# Altium project Zenit Stand_v3.PrjPcb
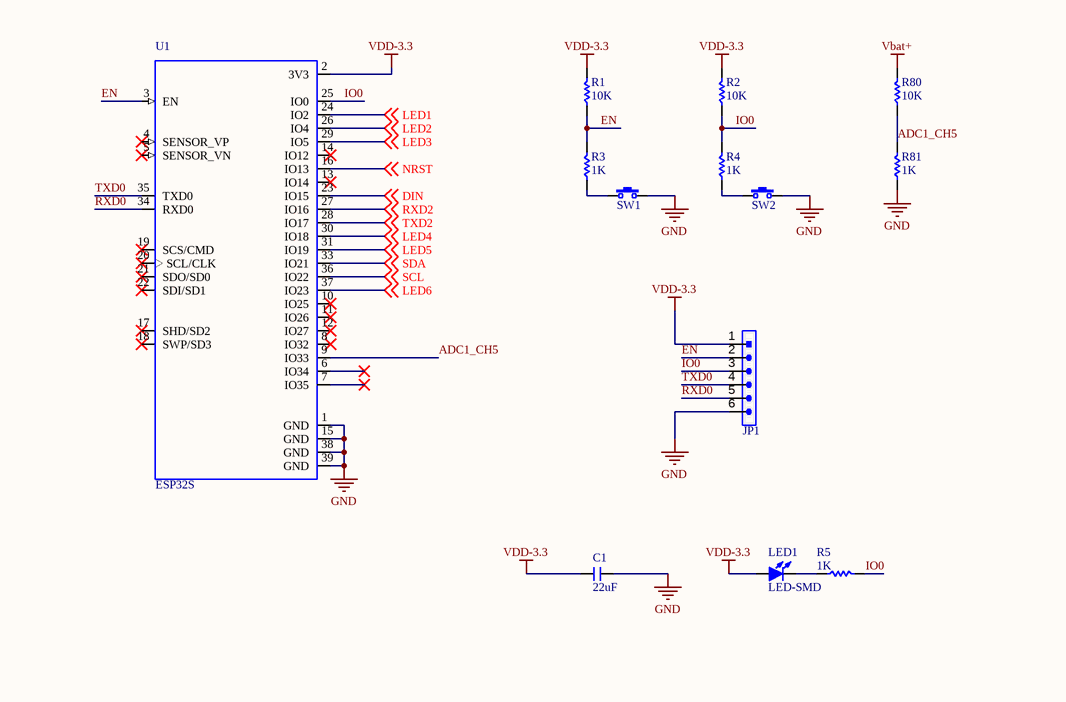
[diagram p0: ESP32.SchDoc]
5 sheets, 130 parts. Net scope: global (net labels, ports and power ports of the same name join across sheets).
Board file: Zenit Stand PCB_3.PcbDoc
Sheets:
  ESP32.SchDoc
  Vemos Battry Shield.SchDoc
  Main.SchDoc
  MPR121.SchDoc
  WS2812.SchDoc

## Sheet ESP32.SchDoc
size A4; SheetNumber: 1; SheetTotal: 6

### Parts
C1  22uF  [C 0805]
JP1  HDR-1X6  [HDR-1X6]  (value not drawn)
LED1  LED-SMD  [LED 0805B]
R1  10K  [R 0805]
R2  10K  [R 0805]
R3  1K  [R 0805]
R4  1K  [R 0805]
R5  1K  [R 0805]
R80  10K  [R 0805]
R81  1K  [R 0805]
SW1  3x6x5  [TSW SMD-3*6*2.5]  (value not drawn)
SW2  3x6x5  [TSW SMD-3*6*2.5]  (value not drawn)
U1  ESP32S  [ESP32S]

### Nets
GND: C1.2 JP1.6 R81.1 SW1.2 SW2.2 U1.1(GND) U1.15(GND) U1.38(GND) U1.39(GND)
Vbat+: R80.2
VDD-3.3: C1.1 JP1.1 LED1.1(A) R1.2 R2.2 U1.2(3V3)
ADC1_CH5: R80.1 R81.2 U1.9(IO33)
DIN: U1.23(IO15) ; off-sheet DIN
EN: JP1.2 R1.1 R3.2 U1.3(EN)
IO0: JP1.3 R2.1 R4.2 R5.2 U1.25(IO0)
LED1: U1.24(IO2) ; off-sheet LED1
LED2: U1.26(IO4) ; off-sheet LED2
LED3: U1.29(IO5) ; off-sheet LED3
LED4: U1.30(IO18) ; off-sheet LED4
LED5: U1.31(IO19) ; off-sheet LED5
LED6: U1.37(IO23) ; off-sheet LED6
NRST: U1.16(IO13) ; off-sheet NRST
RXD0: JP1.5 U1.34(RXD0)
RXD2: U1.27(IO16) ; off-sheet RXD2
SCL: U1.36(IO22) ; off-sheet SCL
SDA: U1.33(IO21) ; off-sheet SDA
TXD0: JP1.4 U1.35(TXD0)
TXD2: U1.28(IO17) ; off-sheet TXD2
NetLED1_2: LED1.2(K) R5.1
NetR3_1: R3.1 SW1.1
NetR4_1: R4.1 SW2.1

Not connected (* = marked no-connect by the designer): U1 4(SENSOR_VP)* 5(SENSOR_VN)* 6(IO34)* 7(IO35)* 8(IO32)* 10(IO25)* 11(IO26)* 12(IO27)* 13(IO14)* 14(IO12)* 17(SHD/SD2)* 18(SWP/SD3)* 19(SCS/CMD)* 20(SCL/CLK)* 21(SDO/SD0)* 22(SDI/SD1)*

### Library data of the parts
C1 = C: Non-polar patch capacitor; BOM名称: 无极性贴片电容; 版权归属: 源创客; 学习资源: www.ooocke.com
JP1 = Header 6: 6P Connector; BOM名称: 6P接插件; 版权归属: 源创客; 学习资源: www.ooocke.com
LED1 = LED-SMD: Patch LED; BOM名称: 贴片LED; 版权归属: 源创客; 学习资源: www.ooocke.com
R1-R5 R80 R81 = R: Chip resistor; 版权归属: 源创客; BOM名称: Chip resistor; 学习资源: www.ooocke.com
SW1 SW2 = TSW 3x6: 3x6 tact switch; BOM名称: 3x6轻触开关; 版权归属: 源创客; 学习资源: www.ooocke.com
U1 = ESP32S: MP: ESP32-WROOM-32D; MF: Espressif Systems; Package: Module Espressif Systems; Price: None; Availability: Unavailable; SnapEDA_Link: https://www.snapeda.com/parts/ESP32-WROOM-32D/Espressif%20Systems/view-part/?ref=snap; Value: *

## Sheet Vemos Battry Shield.SchDoc
size A; SheetNumber: 2; SheetTotal: 6
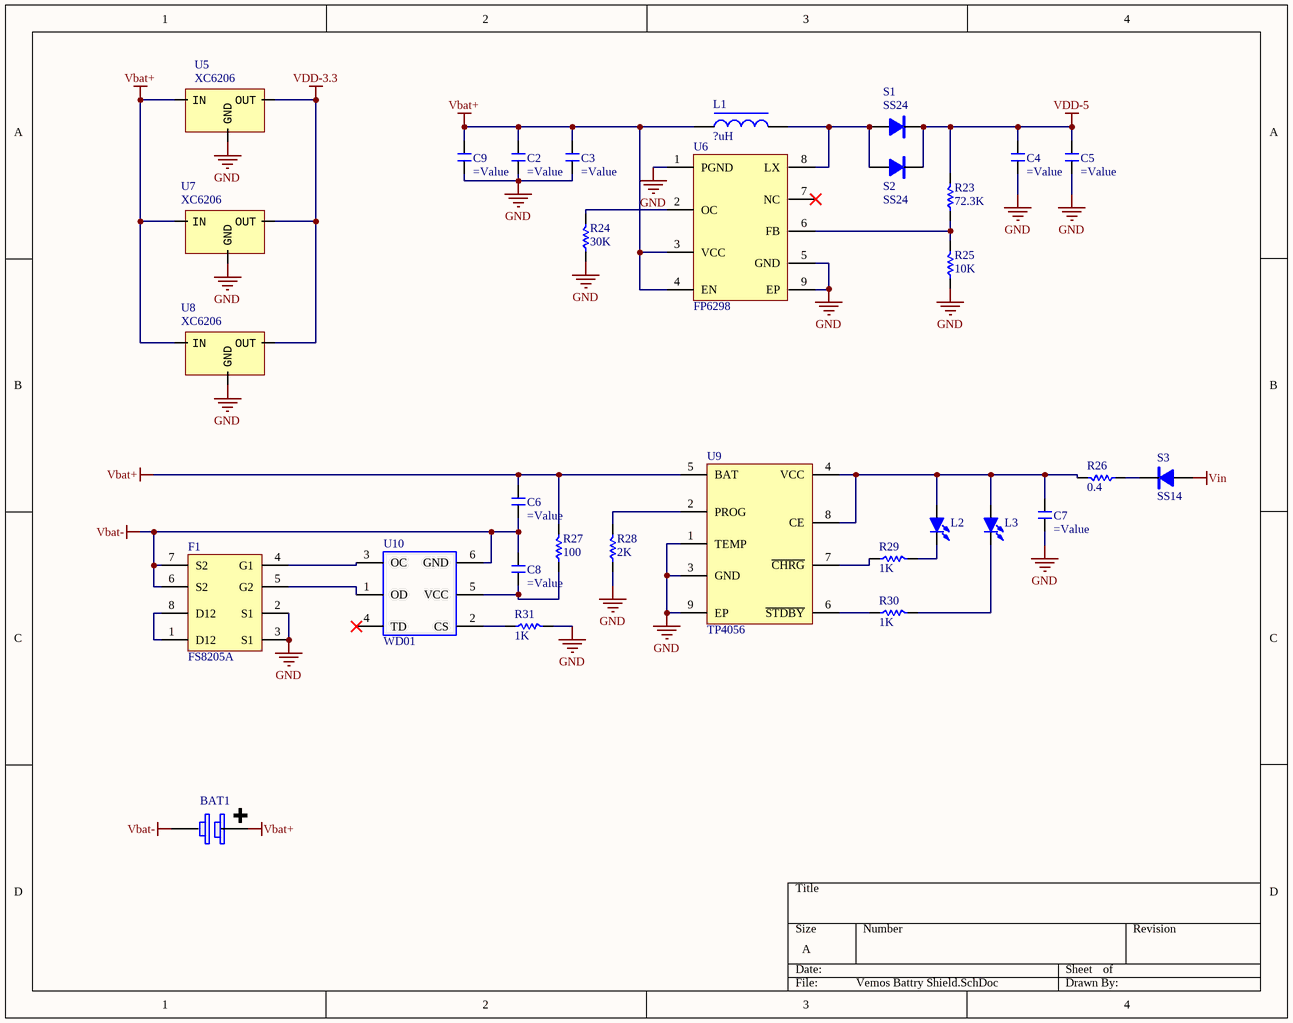
[diagram p1: Vemos Battry Shield.SchDoc]

### Parts
BAT1  Battery 1850  [18650 SINGLE 2]  (value not drawn)
C2  (no value)  [C 0603]
C3  (no value)  [C 0603]
C4  (no value)  [C 0603]
C5  (no value)  [C 0603]
C6  (no value)  [C 0603]
C7  (no value)  [C 0603]
C8  (no value)  [C 0603]
C9  (no value)  [C 0603]
F1  FS8205A  [SSOP8_L]
L1  ?uH  [WHC1040]
L2  LED-SMD  [LED 0805G]  (value not drawn)
L3  LED-SMD  [LED 0805R]  (value not drawn)
R23  72.3K  [R 0603]
R24  30K  [R 0603]
R25  10K  [R 0603]
R26  0.4  [R 0603]
R27  100  [R 0603]
R28  2K  [R 0603]
R29  1K  [R 0603]
R30  1K  [R 0603]
R31  1K  [R 0603]
S1  SS24  [SMA]
S2  SS24  [SMA]
S3  SS14  [SMA]
U5  XC6206  [SOT23-3N]
U6  FP6298  [SOP8_L-EP]
U7  XC6206  [SOT23-3N]
U8  XC6206  [SOT23-3N]
U9  TP4056  [SOP8_M-EP]
U10  WD01  [SOT23-6M]

### Nets
GND: C2.1 C3.1 C4.1 C5.1 C7.1 C9.1 F1.2(S1) F1.3(S1) R24.1 R25.1 R28.1 R31.2 U5.1(GND) U6.1(PGND) U6.5(GND) U6.9(EP) U7.1(GND) U8.1(GND) U9.1(TEMP) U9.3(GND) U9.9(EP)
Vbat+: BAT1.1(+) C2.2 C3.2 C6.2 C9.2 L1.1 R27.2 U5.3(IN) U6.3(VCC) U6.4(EN) U7.3(IN) U8.3(IN) U9.5(BAT)
Vbat-: BAT1.2(-) C6.1 C8.2 F1.6(S2) F1.7(S2) U10.6(GND)
VDD-3.3: U5.2(OUT) U7.2(OUT) U8.2(OUT)
VDD-5: C4.2 C5.2 R23.2 S1.2(K) S2.2(K)
Vin: S3.1(A)
NetC7_2: C7.2 L2.1(A) L3.1(A) R26.2 U9.4(VCC) U9.8(CE)
NetC8_1: C8.1 R27.1 U10.5(VCC)
NetF1_1: F1.1(D12) F1.8(D12)
NetF1_4: F1.4(G1) U10.3(OC)
NetF1_5: F1.5(G2) U10.1(OD)
NetL1_2: L1.2 S1.1(A) S2.1(A) U6.8(LX)
NetL2_2: L2.2(K) R29.2
NetL3_2: L3.2(K) R30.2
NetR23_1: R23.1 R25.2 U6.6(FB)
NetR24_2: R24.2 U6.2(OC)
NetR26_1: R26.1 S3.2(K)
NetR28_2: R28.2 U9.2(PROG)
NetR29_1: R29.1 U9.7(~{CHRG})
NetR30_1: R30.1 U9.6(~{STDBY})
NetR31_1: R31.1 U10.2(CS)

Not connected (* = marked no-connect by the designer): U6 7(NC)*; U10 4(TD)*

### Library data of the parts
C2-C9 = C: as C1 on sheet ESP32; 学习资源: www.ooocke.com
F1 = FS8205A: Dual N-Channel Enhancement Mode Power MOSFET
L1 = L-WHC: One-piece high current inductor
L2 L3 = LED-SMD: Patch LED; BOM名称: 贴片LED; 版权归属: 源创客; 学习资源: www.ooocke.com
R23-R31 = R: Chip resistor; 版权归属: 源创客; BOM名称: Chip resistor; 学习资源: www.ooocke.com
S1 S2 = SS24: Schottky diodes; BOM名称: 肖特基二极管; 版权归属: 源创客; 属性: 40V/2A; 学习资源: www.ooocke.com
S3 = SS14: Schottky diodes; BOM名称: 肖特基二极管; 版权归属: 源创客; 属性: 40V/1A; 学习资源: www.ooocke.com
U5 U7 U8 = XC6206: Power; Type: *; Value: *
U6 = FP6298: FP6298 Low-Noise 4.5A Step-Up Current Mode PWM
U9 = TP4056: Lithium battery charge management; BOM名称: 锂电池充电管理; 版权归属: 源创客; 学习资源: www.ooocke.com
U10 = WD01: Lithium battery overcurrent protection IC; BOM名称: 过流保护IC; 版权归属: 源创客; 学习资源: www.ooocke.com

## Sheet Main.SchDoc
size A; SheetNumber: 3; SheetTotal: 5
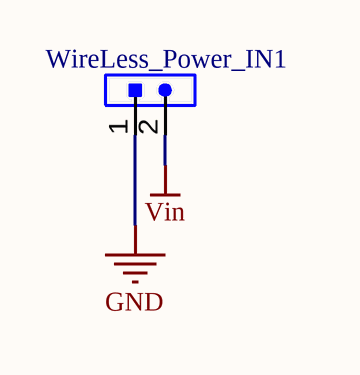
[diagram p2: Main.SchDoc]

### Parts
WireLess_Power_IN1  HDR-1X2  [XH2.54-2P]  (value not drawn)

### Nets
GND: WireLess_Power_IN1.1
Vin: WireLess_Power_IN1.2

### Library data of the parts
WireLess_Power_IN1 = Header 2: 2P Connector; BOM名称: 2P接插件; 版权归属: 源创客; 学习资源: www.ooocke.com

## Sheet MPR121.SchDoc
size A4; SheetNumber: 5; SheetTotal: 6
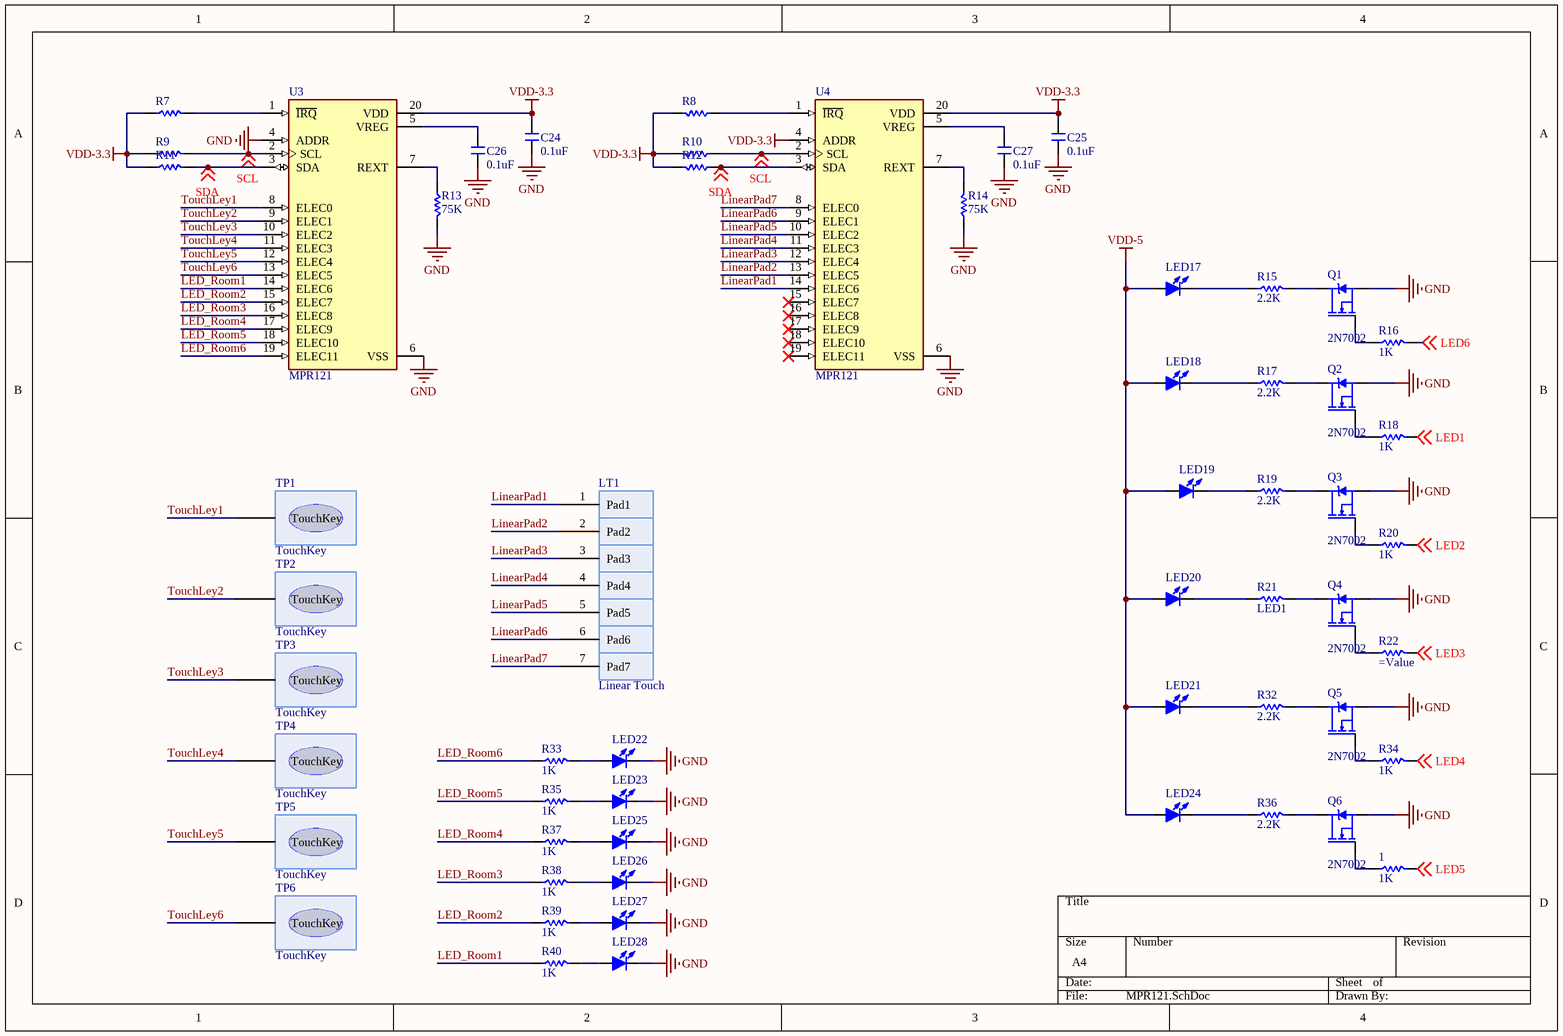
[diagram p3: MPR121.SchDoc]

### Parts
1  1K  [R 0805]
C24  0.1uF  [C 0603]
C25  0.1uF  [C 0603]
C26  0.1uF  [C 0603]
C27  0.1uF  [C 0603]
LED17  (no value)  [LED 3MM-B]
LED18  (no value)  [LED 3MM-B]
LED19  (no value)  [LED 3MM-B]
LED20  (no value)  [LED 3MM-B]
LED21  (no value)  [LED 3MM-B]
LED22  LED-SMD  [LED 1206Y]  (value not drawn)
LED23  LED-SMD  [LED 1206Y]  (value not drawn)
LED24  (no value)  [LED 3MM-B]
LED25  LED-SMD  [LED 1206Y]  (value not drawn)
LED26  LED-SMD  [LED 1206Y]  (value not drawn)
LED27  LED-SMD  [LED 1206Y]  (value not drawn)
LED28  LED-SMD  [LED 1206Y]  (value not drawn)
LT1  Linear Touch  [Linear TouchPad (7Pad)]
Q1  2N7002  [SOT23-3]
Q2  2N7002  [SOT23-3]
Q3  2N7002  [SOT23-3]
Q4  2N7002  [SOT23-3]
Q5  2N7002  [SOT23-3]
Q6  2N7002  [SOT23-3]
R7  (no value)  [R 0603]
R8  (no value)  [R 0603]
R9  (no value)  [R 0603]
R10  (no value)  [R 0603]
R11  (no value)  [R 0603]
R12  (no value)  [R 0603]
R13  75K  [R 0603]
R14  75K  [R 0603]
R15  2.2K  [R 0805]
R16  1K  [R 0805]
R17  2.2K  [R 0805]
R18  1K  [R 0805]
R19  2.2K  [R 0805]
R20  1K  [R 0805]
R21  LED1  [R 0805]
R22  (no value)  [R 0805]
R32  2.2K  [R 0805]
R33  1K  [R 0805]
R34  1K  [R 0805]
R35  1K  [R 0805]
R36  2.2K  [R 0805]
R37  1K  [R 0805]
R38  1K  [R 0805]
R39  1K  [R 0805]
R40  1K  [R 0805]
TP1  TouchKey  [Square TouchKey (1.5cm)]
TP2  TouchKey  [Square TouchKey (1.5cm)]
TP3  TouchKey  [Square TouchKey (1.5cm)]
TP4  TouchKey  [Square TouchKey (1.5cm)]
TP5  TouchKey  [Square TouchKey (1.5cm)]
TP6  TouchKey  [Square TouchKey (1.5cm)]
U3  MPR121  [QFN-20Pin]
U4  MPR121  [QFN-20Pin]

### Nets
GND: C24.1 C25.1 C26.1 C27.1 LED22.2(K) LED23.2(K) LED25.2(K) LED26.2(K) LED27.2(K) LED28.2(K) Q1.2(S) Q2.2(S) Q3.2(S) Q4.2(S) Q5.2(S) Q6.2(S) R13.2 R14.1 U3.4(ADDR) U3.6(VSS) U4.6(VSS)
VDD-3.3: C24.2 C25.2 R7.1 R8.2 R9.1 R10.2 R11.1 R12.2 U3.20(VDD) U4.4(ADDR) U4.20(VDD)
VDD-5: LED17.1(A) LED18.1(A) LED19.1(A) LED20.1(A) LED21.1(A) LED24.1(A)
LED1: R18.2 ; off-sheet LED1
LED2: R20.2 ; off-sheet LED2
LED3: R22.2 ; off-sheet LED3
LED4: R34.2 ; off-sheet LED4
LED5: 1.2 ; off-sheet LED5
LED6: R16.2 ; off-sheet LED6
LED_Room1: R40.1 U3.14(ELEC6)
LED_Room2: R39.1 U3.15(ELEC7)
LED_Room3: R38.1 U3.16(ELEC8)
LED_Room4: R37.1 U3.17(ELEC9)
LED_Room5: R35.1 U3.18(ELEC10)
LED_Room6: R33.1 U3.19(ELEC11)
LinearPad1: LT1.1(Pad1) U4.14(ELEC6)
LinearPad2: LT1.2(Pad2) U4.13(ELEC5)
LinearPad3: LT1.3(Pad3) U4.12(ELEC4)
LinearPad4: LT1.4(Pad4) U4.11(ELEC3)
LinearPad5: LT1.5(Pad5) U4.10(ELEC2)
LinearPad6: LT1.6(Pad6) U4.9(ELEC1)
LinearPad7: LT1.7(Pad7) U4.8(ELEC0)
SCL: R9.2 R10.1 U3.2(SCL) U4.2(SCL) ; off-sheet SCL
SDA: R11.2 R12.1 U3.3(SDA) U4.3(SDA) ; off-sheet SDA
TouchLey1: TP1.1(TouchKey) U3.8(ELEC0)
TouchLey2: TP2.1(TouchKey) U3.9(ELEC1)
TouchLey3: TP3.1(TouchKey) U3.10(ELEC2)
TouchLey4: TP4.1(TouchKey) U3.11(ELEC3)
TouchLey5: TP5.1(TouchKey) U3.12(ELEC4)
TouchLey6: TP6.1(TouchKey) U3.13(ELEC5)
Net1_1: 1.1 Q6.1(G)
NetC26_2: C26.2 U3.5(VREG)
NetC27_2: C27.2 U4.5(VREG)
NetLED17_2: LED17.2(K) R15.1
NetLED18_2: LED18.2(K) R17.1
NetLED19_2: LED19.2(K) R19.1
NetLED20_2: LED20.2(K) R21.1
NetLED21_2: LED21.2(K) R32.1
NetLED22_1: LED22.1(A) R33.2
NetLED23_1: LED23.1(A) R35.2
NetLED24_2: LED24.2(K) R36.1
NetLED25_1: LED25.1(A) R37.2
NetLED26_1: LED26.1(A) R38.2
NetLED27_1: LED27.1(A) R39.2
NetLED28_1: LED28.1(A) R40.2
NetQ1_1: Q1.1(G) R16.1
NetQ1_3: Q1.3(D) R15.2
NetQ2_1: Q2.1(G) R18.1
NetQ2_3: Q2.3(D) R17.2
NetQ3_1: Q3.1(G) R20.1
NetQ3_3: Q3.3(D) R19.2
NetQ4_1: Q4.1(G) R22.1
NetQ4_3: Q4.3(D) R21.2
NetQ5_1: Q5.1(G) R34.1
NetQ5_3: Q5.3(D) R32.2
NetQ6_3: Q6.3(D) R36.2
NetR7_2: R7.2 U3.1(~{IRQ})
NetR8_1: R8.1 U4.1(~{IRQ})
NetR13_1: R13.1 U3.7(REXT)
NetR14_2: R14.2 U4.7(REXT)

Not connected (* = marked no-connect by the designer): U4 15(ELEC7)* 16(ELEC8)* 17(ELEC9)* 18(ELEC10)* 19(ELEC11)*

### Library data of the parts
1 R7-R22 R32-R40 = R: Chip resistor; 版权归属: 源创客; BOM名称: Chip resistor; 学习资源: www.ooocke.com
C24-C27 = C: as C1 on sheet ESP32; 学习资源: www.ooocke.com
LED17-LED21 LED24 = LED-3MM: Plug-in LED; BOM名称: 插件LED; 版权归属: 源创客; 学习资源: www.ooocke.com
LED22 LED23 LED25-LED28 = LED-SMD: Patch LED; BOM名称: 贴片LED; 版权归属: 源创客; 学习资源: www.ooocke.com
Q1-Q6 = 2N7002: N-Channel 60V 115mA (Tc) 225mW (Ta) Surface Mount SOT-23-3 (TO-236); MF: STMicroelectronics; Package: SOT-23-3 Vishay; Value: *; Check_prices: https://www.snapeda.com/parts/2N7002/STMicroelectronics/view-part/2885412/?ref=eda; SnapEDA_Link: https://www.snapeda.com/parts/2N7002/STMicroelectronics/view-part/2885412/?ref=snap; Availability: Good; Price: None; MP: 2N7002; Purchase-URL: https://pricing.snapeda.com/search/part/2N7002/?ref=eda

## Sheet WS2812.SchDoc
size A; SheetNumber: 6; SheetTotal: 6
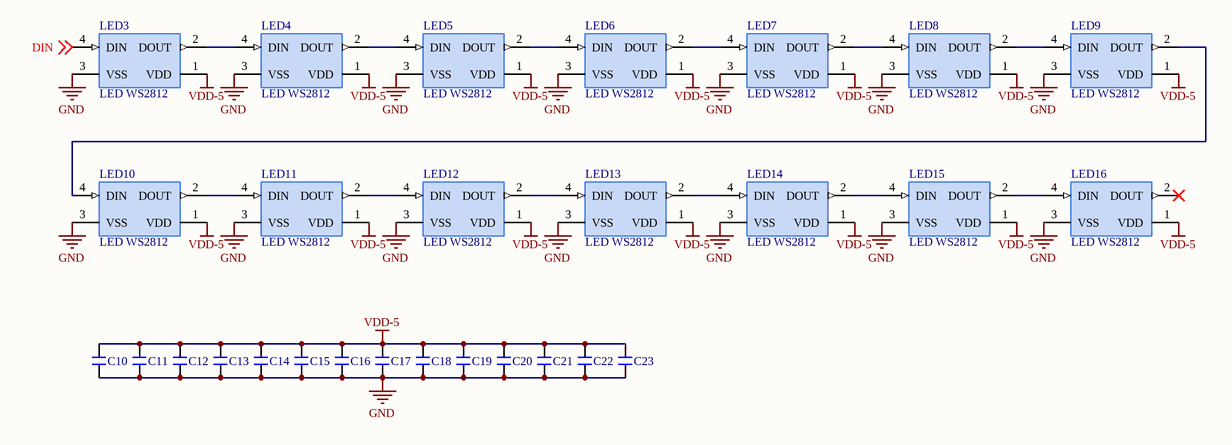
[diagram p4: WS2812.SchDoc]

### Parts
C10  (no value)  [C 0805]
C11  (no value)  [C 0805]
C12  (no value)  [C 0805]
C13  (no value)  [C 0805]
C14  (no value)  [C 0805]
C15  (no value)  [C 0805]
C16  (no value)  [C 0805]
C17  (no value)  [C 0805]
C18  (no value)  [C 0805]
C19  (no value)  [C 0805]
C20  (no value)  [C 0805]
C21  (no value)  [C 0805]
C22  (no value)  [C 0805]
C23  (no value)  [C 0805]
LED3  LED WS2812  [LED WS2812 (5050)]
LED4  LED WS2812  [LED WS2812 (5050)]
LED5  LED WS2812  [LED WS2812 (5050)]
LED6  LED WS2812  [LED WS2812 (5050)]
LED7  LED WS2812  [LED WS2812 (5050)]
LED8  LED WS2812  [LED WS2812 (5050)]
LED9  LED WS2812  [LED WS2812 (5050)]
LED10  LED WS2812  [LED WS2812 (5050)]
LED11  LED WS2812  [LED WS2812 (5050)]
LED12  LED WS2812  [LED WS2812 (5050)]
LED13  LED WS2812  [LED WS2812 (5050)]
LED14  LED WS2812  [LED WS2812 (5050)]
LED15  LED WS2812  [LED WS2812 (5050)]
LED16  LED WS2812  [LED WS2812 (5050)]

### Nets
GND: C10.1 C11.1 C12.1 C13.1 C14.1 C15.1 C16.1 C17.1 C18.1 C19.1 C20.1 C21.1 C22.1 C23.1 LED3.3(VSS) LED4.3(VSS) LED5.3(VSS) LED6.3(VSS) LED7.3(VSS) LED8.3(VSS) LED9.3(VSS) LED10.3(VSS) LED11.3(VSS) LED12.3(VSS) LED13.3(VSS) LED14.3(VSS) LED15.3(VSS) LED16.3(VSS)
VDD-5: C10.2 C11.2 C12.2 C13.2 C14.2 C15.2 C16.2 C17.2 C18.2 C19.2 C20.2 C21.2 C22.2 C23.2 LED3.1(VDD) LED4.1(VDD) LED5.1(VDD) LED6.1(VDD) LED7.1(VDD) LED8.1(VDD) LED9.1(VDD) LED10.1(VDD) LED11.1(VDD) LED12.1(VDD) LED13.1(VDD) LED14.1(VDD) LED15.1(VDD) LED16.1(VDD)
DIN: LED3.4(DIN) ; off-sheet DIN
NetLED3_2: LED3.2(DOUT) LED4.4(DIN)
NetLED4_2: LED4.2(DOUT) LED5.4(DIN)
NetLED5_2: LED5.2(DOUT) LED6.4(DIN)
NetLED6_2: LED6.2(DOUT) LED7.4(DIN)
NetLED7_2: LED7.2(DOUT) LED8.4(DIN)
NetLED8_2: LED8.2(DOUT) LED9.4(DIN)
NetLED9_2: LED9.2(DOUT) LED10.4(DIN)
NetLED10_2: LED10.2(DOUT) LED11.4(DIN)
NetLED11_2: LED11.2(DOUT) LED12.4(DIN)
NetLED12_2: LED12.2(DOUT) LED13.4(DIN)
NetLED13_2: LED13.2(DOUT) LED14.4(DIN)
NetLED14_2: LED14.2(DOUT) LED15.4(DIN)
NetLED15_2: LED15.2(DOUT) LED16.4(DIN)

Not connected (* = marked no-connect by the designer): LED16 2(DOUT)*

### Library data of the parts
C10-C23 = C: as C1 on sheet ESP32; 学习资源: www.ooocke.com

## Nets that join several sheets
GND: ESP32 (9 pins), Vemos Battry Shield (21 pins), Main (WireLess_Power_IN1.1), MPR121 (21 pins), WS2812 (28 pins)
Vbat+: ESP32 (R80.2), Vemos Battry Shield (13 pins)
VDD-3.3: ESP32 (6 pins), Vemos Battry Shield (U5.2 U7.2 U8.2), MPR121 (11 pins)
VDD-5: Vemos Battry Shield (5 pins), MPR121 (6 pins), WS2812 (28 pins)
Vin: Vemos Battry Shield (S3.1), Main (WireLess_Power_IN1.2)
DIN: ESP32 (U1.23), WS2812 (LED3.4)
LED1: ESP32 (U1.24), MPR121 (R18.2)
LED2: ESP32 (U1.26), MPR121 (R20.2)
LED3: ESP32 (U1.29), MPR121 (R22.2)
LED4: ESP32 (U1.30), MPR121 (R34.2)
LED5: ESP32 (U1.31), MPR121 (1.2)
LED6: ESP32 (U1.37), MPR121 (R16.2)
SCL: ESP32 (U1.36), MPR121 (R9.2 R10.1 U3.2 U4.2)
SDA: ESP32 (U1.33), MPR121 (R11.2 R12.1 U3.3 U4.3)